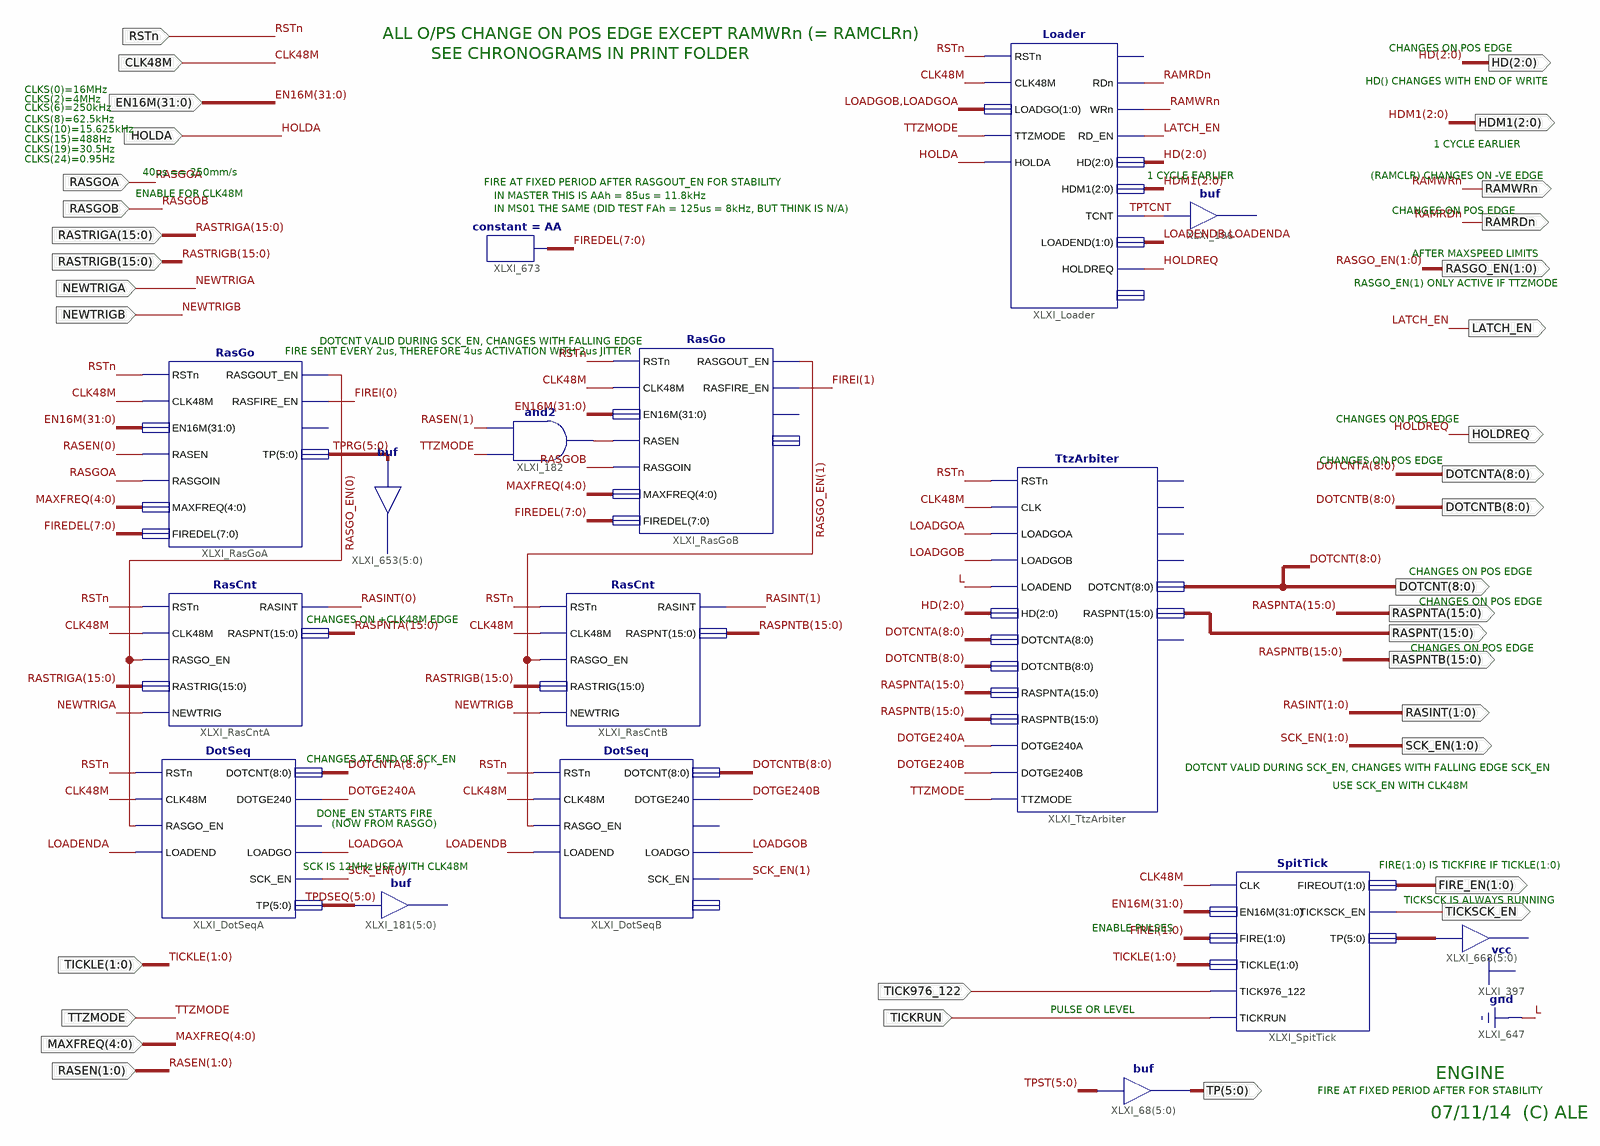
[diagram p0: schematic sheet 1]
// Xilinx ISE schematic Engine.sch (spartan3e) as structural Verilog: 16 symbols, 34 ports
module Engine (
  input  RSTn,
  input  TTZMODE,
  input  RASGOA,
  input  RASGOB,
  input  [15:0] RASTRIGA,
  input  NEWTRIGA,
  input  [15:0] RASTRIGB,
  input  NEWTRIGB,
  input  HOLDA,
  input  [4:0] MAXFREQ,
  input  [1:0] RASEN,
  input  CLK48M,
  input  [31:0] EN16M,
  input  TICK976_122,
  input  TICKRUN,
  input  [1:0] TICKLE,
  output [2:0] HD,
  output [8:0] DOTCNT,
  output [8:0] DOTCNTB,
  output [8:0] DOTCNTA,
  output [15:0] RASPNTB,
  output [15:0] RASPNTA,
  output LATCH_EN,
  output RAMRDn,
  output HOLDREQ,
  output [5:0] TP,
  output [15:0] RASPNT,
  output [1:0] RASINT,
  output [1:0] SCK_EN,
  output [2:0] HDM1,
  output [1:0] FIRE_EN,
  output TICKSCK_EN,
  output [1:0] RASGO_EN,
  output RAMWRn
);

  wire DOTGE240A, DOTGE240B, LOADENDA, LOADENDB, LOADGOA, LOADGOB, TPTCNT, XLXN_152;
  wire [1:0] FIREI;
  wire [5:0] TPDSEQ, TPRG, TPST;
  wire [7:0] FIREDEL;

  TtzArbiter XLXI_TtzArbiter (
    .CLK(CLK48M), .DOTCNT(DOTCNT), .DOTCNTA(DOTCNTA), .DOTCNTB(DOTCNTB), .DOTGE240A(DOTGE240A),
    .DOTGE240B(DOTGE240B), .HD(HD), .LOADEND(1'b0), .LOADGOA(LOADGOA), .LOADGOB(LOADGOB), .RASPNT(RASPNT),
    .RASPNTA(RASPNTA), .RASPNTB(RASPNTB), .RSTn(RSTn), .TTZMODE(TTZMODE));  // open: DOTGE240, LOADENDA, LOADENDB, LOADGO, ZONEYES
  // buf XLXI_196 has open pins: I=TPTCNT, O=open
  Loader XLXI_Loader (
    .CLK48M(CLK48M), .HD(HD), .HDM1(HDM1), .HOLDA(HOLDA), .HOLDREQ(HOLDREQ), .LOADEND({LOADENDB, LOADENDA}),
    .LOADGO({LOADGOB, LOADGOA}), .RDn(RAMRDn), .RD_EN(LATCH_EN), .RSTn(RSTn), .TCNT(TPTCNT),
    .TTZMODE(TTZMODE), .WRn(RAMWRn));  // open: CEn, TP
  // buf XLXI_668[5..0] has open pins: I=TPST, O=open
  assign TP = TPST;  // buf XLXI_68[5..0], 6 bits wide
  SpitTick XLXI_SpitTick (
    .CLK(CLK48M), .EN16M(EN16M), .FIRE(FIREI), .FIREOUT(FIRE_EN), .TICK976_122(TICK976_122), .TICKLE(TICKLE),
    .TICKRUN(TICKRUN), .TICKSCK_EN(TICKSCK_EN), .TP(TPST));
  RasCnt XLXI_RasCntA (
    .CLK48M(CLK48M), .NEWTRIG(NEWTRIGA), .RASGO_EN(RASGO_EN[0]), .RASINT(RASINT[0]), .RASPNT(RASPNTA),
    .RASTRIG(RASTRIGA), .RSTn(RSTn));
  RasCnt XLXI_RasCntB (
    .CLK48M(CLK48M), .NEWTRIG(NEWTRIGB), .RASGO_EN(RASGO_EN[1]), .RASINT(RASINT[1]), .RASPNT(RASPNTB),
    .RASTRIG(RASTRIGB), .RSTn(RSTn));
  // buf XLXI_181[5..0] has open pins: I=TPDSEQ, O=open
  DotSeq XLXI_DotSeqA (
    .CLK48M(CLK48M), .DOTCNT(DOTCNTA), .DOTGE240(DOTGE240A), .LOADEND(LOADENDA), .LOADGO(LOADGOA),
    .RASGO_EN(RASGO_EN[0]), .RSTn(RSTn), .SCK_EN(SCK_EN[0]), .TP(TPDSEQ));  // open: DONE_EN
  DotSeq XLXI_DotSeqB (
    .CLK48M(CLK48M), .DOTCNT(DOTCNTB), .DOTGE240(DOTGE240B), .LOADEND(LOADENDB), .LOADGO(LOADGOB),
    .RASGO_EN(RASGO_EN[1]), .RSTn(RSTn), .SCK_EN(SCK_EN[1]));  // open: DONE_EN, TP
  RasGo XLXI_RasGoA (
    .CLK48M(CLK48M), .EN16M(EN16M), .FIREDEL(FIREDEL), .MAXFREQ(MAXFREQ), .RASEN(RASEN[0]),
    .RASFIRE_EN(FIREI[0]), .RASGOIN(RASGOA), .RASGOUT_EN(RASGO_EN[0]), .RSTn(RSTn), .TP(TPRG));  // open: TCNT
  RasGo XLXI_RasGoB (
    .CLK48M(CLK48M), .EN16M(EN16M), .FIREDEL(FIREDEL), .MAXFREQ(MAXFREQ), .RASEN(XLXN_152),
    .RASFIRE_EN(FIREI[1]), .RASGOIN(RASGOB), .RASGOUT_EN(RASGO_EN[1]), .RSTn(RSTn));  // open: TCNT, TP
  // buf XLXI_653[5..0] has open pins: I=TPRG, O=open
  and XLXI_182 (XLXN_152, TTZMODE, RASEN[1]);
  constant #(.CValue("AA")) XLXI_673 (.O(FIREDEL));

  // Notes on the sheet:
  //   ALL O/PS CHANGE ON POS EDGE EXCEPT RAMWRn (= RAMCLRn)
  //   CHANGES ON POS EDGE
  //   SEE CHRONOGRAMS IN PRINT FOLDER
  //   HD() CHANGES WITH END OF WRITE
  //   CLKS(0)=16MHz
  //   CLKS(2)=4MHz
  //   CLKS(6)=250kHz
  //   CLKS(8)=62.5kHz
  //   CLKS(10)=15.625kHz
  //   CLKS(15)=488Hz
  //   1 CYCLE EARLIER
  //   CLKS(19)=30.5Hz
  //   CLKS(24)=0.95Hz
  //   40us == 250mm/s
  //   1 CYCLE EARLIER
  //   (RAMCLR) CHANGES ON -VE EDGE
  //   FIRE AT FIXED PERIOD AFTER RASGOUT_EN FOR STABILITY
  //   ENABLE FOR CLK48M
  //   IN MASTER THIS IS AAh = 85us = 11.8kHz
  //   IN MS01 THE SAME (DID TEST FAh = 125us = 8kHz, BUT THINK IS N/A)
  //   CHANGES ON POS EDGE
  //   AFTER MAXSPEED LIMITS
  //   RASGO_EN(1) ONLY ACTIVE IF TTZMODE
  //   DOTCNT VALID DURING SCK_EN, CHANGES WITH FALLING EDGE
  //   FIRE SENT EVERY 2us, THEREFORE 4us ACTIVATION WITH 2us JITTER
  //   CHANGES ON POS EDGE
  //   CHANGES ON POS EDGE
  //   CHANGES ON POS EDGE
  //   CHANGES ON POS EDGE
  //   CHANGES ON +CLK48M EDGE
  //   CHANGES ON POS EDGE
  //   CHANGES AT END OF SCK_EN
  //   DOTCNT VALID DURING SCK_EN, CHANGES WITH FALLING EDGE SCK_EN
  //   USE SCK_EN WITH CLK48M
  //   DONE_EN STARTS FIRE
  //   (NOW FROM RASGO)
  //   FIRE(1:0) IS TICKFIRE IF TICKLE(1:0)
  //   SCK IS 12MHz
  //   USE WITH CLK48M
  //   TICKSCK IS ALWAYS RUNNING
  //   ENABLE PULSES
  //   PULSE OR LEVEL
  //   ENGINE
  //   FIRE AT FIXED PERIOD AFTER FOR STABILITY
  //   07/11/14  (C) ALE
endmodule
